# Altium schematic sheet CPCIS_Connectors_P1_P6.SchDoc
size 420 x 297 mm; Organization: WUT; DocumentNumber: 1; SheetNumber: 10; Title2: CPCIS Connectors; SPICEModelCacheRMUUFYQV: <root> / <DocumentId>RMUUFYQV</DocumentId> / <CacheFrame Number="0"> / <Model Name="kpp" Kind="GlobalParam"> / <Text>.param KPP = 3.0E-05</Text> / </Model> / <Model Name="ldp" Kind="GlobalParam"> / <Text>.param LDP = 0.07U</Text> / </Model> / <Model Name="vtop" Kind="GlobalParam"> / <Text>.param VTOP = 0.14</Text> / </Model> / <Model Name="rpar" Kind="GlobalParam"> / <Text>.param RPAR = 1T</Text> / </Model> / <Model Name="cbdj" Kind="GlobalParam"> / <Text>.param CBDJ = 1</Text> / </Model> / <Model Name="cn" Kind="GlobalParam"> / <Text>.param CN = 0.8</Text> / </Model> / <Model Name="cjp" Kind="GlobalParam"> / <Text>.param CJP = CN*300U</Text> / <Dependency>0\cn</Dependency> / </Model> / <Model Name="ls" Kind="GlobalParam"> / <Text>.param LS = 1.0U</Text> / </Model> / <Model Name="cbds" Kind="GlobalParam"> / <Text>.param CBDS = 1</Text> / </Model> / <Model Name="cjswp" Kind="GlobalParam"> / <Text>.param CJSWP = CN*2.2N</Text> / <Dependency>0\cn</Dependency> / </Model> / <Model Name="epssio2" Kind="GlobalParam"> / <Text>.param EPSSIO2 = 3.9*8.854214871E-12</Text> / </Model> / <Model Name="tox" Kind="GlobalParam"> / <Text>.param TOX = 1000E-10</Text> / </Model> / <Model Name="cox" Kind="GlobalParam"> / <Text>.param COX = EPSSIO2/TOX</Text> / <Dependency>0\epssio2</Dependency> / <Dependency>0\tox</Dependency> / </Model> / <Model Name="xjn" Kind="GlobalParam"> / <Text>.param XJN = 0.2U</Text> / </Model> / <Model Name="cgsop" Kind="GlobalParam"> / <Text>.param CGSOP = CN*0.6 * XJN * COX</Text> / <Dependency>0\cn</Dependency> / <Dependency>0\xjn</Dependency> / <Dependency>0\cox</Dependency> / </Model> / <Model Name="cgdop" Kind="GlobalParam"> / <Text>.param CGDOP = CGSOP</Text> / <Dependency>0\cgsop</Dependency> / </Model> / <Model Name="isz" Kind="GlobalParam"> / <Text>.param ISZ = 5P</Text> / </Model> / <Model Name="kpn" Kind="GlobalParam"> / <Text>.param KPN = 6.0E-05</Text> / </Model> / <Model Name="ldn" Kind="GlobalParam"> / <Text>.param LDN = 0.07U</Text> / </Model> / <Model Name="rsw" Kind="GlobalParam"> / <Text>.param RSW = 1810</Text> / </Model> / <Model Name="rsn" Kind="GlobalParam"> / <Text>.param RSN = 1.41</Text> / </Model> / <Model Name="vbmul" Kind="GlobalParam"> / <Text>.param VBMUL = 1E6</Text> / </Model> / <Model Name="vtohp" Kind="GlobalParam"> / <Text>.param VTOHP = 0.85</Text> / </Model> / <Model Name="lambda" Kind="GlobalParam"> / <Text>.param LAMBDA = 2M</Text> / </Model> / <Model Name="vtohn" Kind="GlobalParam"> / <Text>.param VTOHN = 0.80</Text> / </Model> / <Model Name="ibias" Kind="CKT"> / <Text>* / .SUBCKT IBIAS VCC GND VIB / * / .PARAM M1 = 8 / .PARAM M2 = 5 / .PARAM MP = 1 / .PARAM WP = 13U / .PARAM WN = 130U / .PARAM LPE = {36U - LDP} / .PARAM LNE = {13U - LDN} / .PARAM BP = {MP*(WP/LPE)*(KPP/2)} / .PARAM WW = 13U / .PARAM LW = 213U / .PARAM WNN = 25U / .PARAM LNN = 87U / .PARAM R1 = {(RSW*LW/WW + RSN*LNN/WNN)} / .PARAM K2 = {M2*(WN/LNE)*(KPN/2)} / .PARAM MR = {M2/M1} / * / R1 VIB GND {VBMUL} / GB  VCC VIB  VALUE = {LIMIT( IF ( V(VCC,GND) &gt; VTOHP, BP*PWR(V(VCC,GND)-VTOHP, 2), 0), / + (1 + 1*LAMBDA*(V(VCC,GND) - VTOHN))*PWR(( 1 - SQRT(MR/(1+2*LAMBDA*(V(VCC,GND) - VTOHP))) )/R1, 2)/K2, 0)} / R2 VIB VCC {RPAR} / .ENDS</Text> / <Dependency>0\kpp</Dependency> / <Dependency>0\kpn</Dependency> / <Dependency>0\ldn</Dependency> / <Dependency>0\ldp</Dependency> / <Dependency>0\rsw</Dependency> / <Dependency>0\rsn</Dependency> / <Dependency>0\vbmul</Dependency> / <Dependency>0\vtohp</Dependency> / <Dependency>0\lambda</Dependency> / <Dependency>0\vtohn</Dependency> / <Dependency>0\rpar</Dependency> / </Model> / <Model Name="vton" Kind="GlobalParam"> / <Text>.param VTON = 0.14</Text> / </Model> / <Model Name="cjn" Kind="GlobalParam"> / <Text>.param CJN = CN*180U</Text> / <Dependency>0\cn</Dependency> / </Model> / <Model Name="cjswn" Kind="GlobalParam"> / <Text>.param CJSWN = CN*1N</Text> / <Dependency>0\cn</Dependency> / </Model> / <Model Name="cgson" Kind="GlobalParam"> / <Text>.param CGSON = CN*0.6 * XJN * COX</Text> / <Dependency>0\cn</Dependency> / <Dependency>0\xjn</Dependency> / <Dependency>0\cox</Dependency> / </Model> / <Model Name="cgdon" Kind="GlobalParam"> / <Text>.param CGDON = CGSON</Text> / <Dependency>0\cgson</Dependency> / </Model> / <Model Name="tlc55x_rwelld" Kind="CKT"> / <Text>*$ / .SUBCKT TLC55X_RWELLD  1 2 PARAMS: W = 10U L = 100U / R1 1 2 {RSW*L/W} / .ENDS</Text> / <Dependency>0\rsw</Dependency> / </Model> / <Model Name="tlc55x_rwell" Kind="CKT"> / <Text>*+ RSH= 10 / *$ / .SUBCKT TLC55X_RWELL  1 2 PARAMS: W = 10U L = 100U / XR1 1 2 TLC55X_RWELLD PARAMS: W = {W} L = {L} / .ENDS</Text> / <Dependency>0\tlc55x_rwelld</Dependency> / </Model> / <Model Name="mdswn" Kind="CKT"> / <Text>.SUBCKT MDSWN D S DG GND PARAMS: W = 100U L = 10U M = 1 / * / .PARAM LE = {L - LDN} / * / S1 D S DG GND SWN / C1 D S {M*(CBDJ*CJN*LS*W + CBDS*CJSWN*(2*LS + W))} / *D B / .MODEL SWN VSWITCH ( VON = {0.55} VOFF = {0.49} RON={1/(2*M*(W/LE)*(KPN/2)*10)} ROFF={1G} ) / .ENDS</Text> / <Dependency>0\kpn</Dependency> / <Dependency>0\ldn</Dependency> / <Dependency>0\cbdj</Dependency> / <Dependency>0\cjn</Dependency> / <Dependency>0\ls</Dependency> / <Dependency>0\cbds</Dependency> / <Dependency>0\cjswn</Dependency> / </Model> / <Model Name="ccg" Kind="GlobalParam"> / <Text>.param CCG = 0.2</Text> / </Model> / <Model Name="xjncg" Kind="GlobalParam"> / <Text>.param XJNCG = 0.2U</Text> / </Model> / <Model Name="toxcg" Kind="GlobalParam"> / <Text>.param TOXCG = 1000E-10</Text> / </Model> / <Model Name="coxcg" Kind="GlobalParam"> / <Text>.param COXCG = EPSSIO2/TOXCG</Text> / <Dependency>0\epssio2</Dependency> / <Dependency>0\toxcg</Dependency> / </Model> / <Model Name="cgsoncg" Kind="GlobalParam"> / <Text>.param CGSONCG = CCG*0.6 * XJNCG * COXCG</Text> / <Dependency>0\ccg</Dependency> / <Dependency>0\xjncg</Dependency> / <Dependency>0\coxcg</Dependency> / </Model> / <Model Name="cgdoncg" Kind="GlobalParam"> / <Text>.param CGDONCG = CGSONCG</Text> / <Dependency>0\cgsoncg</Dependency> / </Model> / <Model Name="cjncg" Kind="GlobalParam"> / <Text>.param CJNCG = CCG*180U</Text> / <Dependency>0\ccg</Dependency> / </Model> / <Model Name="cjswncg" Kind="GlobalParam"> / <Text>.param CJSWNCG = CCG*1N</Text> / <Dependency>0\ccg</Dependency> / </Model> / <Model Name="vtomp" Kind="GlobalParam"> / <Text>.param VTOMP = 0.6</Text> / </Model> / <Model Name="tlc55x_pmosd_mv" Kind="MDL"> / <Text>*$ / .MODEL TLC55X_PMOSD_MV PMOS LEVEL=1 L=10U W=100U KP={KPP} VTO={-VTOMP} LAMBDA=2E-3 / *+ CJ={CJP} CJSW={CJSWP} CGSO={CGSOP} CGDO={CGDOP} PB=0.65 LD=70N TOX={TOX} / + CJ={CJNCG} CJSW={CJSWNCG} CGSO={CGSONCG} CGDO={CGDONCG} PB=0.65 LD= 70N TOX={TOXCG}</Text> / <Dependency>0\cgdoncg</Dependency> / <Dependency>0\cgsoncg</Dependency> / <Dependency>0\cjncg</Dependency> / <Dependency>0\cjswncg</Dependency> / <Dependency>0\kpp</Dependency> / <Dependency>0\toxcg</Dependency> / <Dependency>0\vtomp</Dependency> / </Model> / <Model Name="tlc55x_pmos_mv" Kind="CKT"> / <Text>*$ / .SUBCKT TLC55X_PMOS_MV  D G S B PARAMS: W = 100U L = 10U M = 1 / M1 D G S B TLC55X_PMOSD_MV W = {W} L = {L} M = {M} AD={W*LS} AS={W*LS} PD={W + 2*LS} PS={W + 2*LS} / + NRD={LS/W} NRS={LS/W} / .ENDS</Text> / <Dependency>0\tlc55x_pmosd_mv</Dependency> / <Dependency>0\ls</Dependency> / </Model> / <Model Name="mdswp" Kind="CKT"> / <Text>.SUBCKT MDSWP D S DG GND PARAMS: W = 100U L = 10U M = 1 / * / .PARAM LE = {L - LDP} / * / S1 D S DG GND SWN / C1 D S {M*(CBDJ*CJP*LS*W + CBDS*CJSWP*(2*LS + W))} / *D B / .MODEL SWN VSWITCH ( VON = {0.49} VOFF = {0.55} RON={1/(2*M*(W/LE)*(KPP/2)*10)} ROFF={1G} ) / .ENDS</Text> / <Dependency>0\kpp</Dependency> / <Dependency>0\ldp</Dependency> / <Dependency>0\cbdj</Dependency> / <Dependency>0\cjp</Dependency> / <Dependency>0\ls</Dependency> / <Dependency>0\cbds</Dependency> / <Dependency>0\cjswp</Dependency> / </Model> / <Model Name="comp2inpnorsd" Kind="CKT"> / <Text>.SUBCKT COMP2INPNORSD IN1+ IN1- IN2+ IN2- OUT GND / + PARAMS: ROUT=0 DELAYLH=0 DELAYHL=0 VOUTH=0 VOUTL=0 VTHRES1=0 VTHRES2=0 / * / .PARAM TDELLH = {IF ( (DELAYLH &lt; 1E-9) , 1E-9, DELAYLH ) } / .PARAM TDELHL = {IF ( (DELAYHL &lt; 1E-9) , 1E-9, DELAYHL ) } / .PARAM RO = {IF ( (TDEL &gt; 1E-15) &amp; (ROUT &lt; 1), 1, ROUT ) } / .PARAM TDEL = {(TDELLH+TDELHL)/2} / .PARAM COUT={TDEL/(0.693*(RO+1U))} / .PARAM RDELLH = {TDELLH/(0.693*(COUT+1F))} / .PARAM RDELHL = {TDELHL/(0.693*(COUT+1F))} / EOUT OUT GND VALUE= { IF ( (V(IN1+,IN1-) &gt; {VTHRES1}) | (V(IN2+,IN2-) &gt; {VTHRES2}), / + VOUTL + RDELLH*I(EOUT), VOUTH + RDELHL*I(EOUT) ) } / COUT OUT GND {COUT} / .ENDS COMP2INPNORSD</Text> / </Model> / <Model Name="comp3inpnorsd" Kind="CKT"> / <Text>.SUBCKT COMP3INPNORSD IN1+ IN1- IN2+ IN2- IN3+ IN3- OUT VCC GND / + PARAMS: ROUT=0 DELAYLH=0 DELAYHL=0 VOUTH=0 VOUTL=0 VTHRES1=0 VHYST1=0 VTHRES2=0 VHYST2=0 VTHRES3=0 VHYST3=0 / * / .PARAM TDELLH = {IF ( (DELAYLH &lt; 1E-9) , 1E-9, DELAYLH ) } / .PARAM TDELHL = {IF ( (DELAYHL &lt; 1E-9) , 1E-9, DELAYHL ) } / .PARAM RO = {IF ( (TDEL &gt; 1E-15) &amp; (ROUT &lt; 1), 1, ROUT ) } / .PARAM TDEL = {(TDELLH+TDELHL)/2} / .PARAM COUT={TDEL/(0.693*(RO+1U))} / .PARAM VREFN = {(15-VTOHN)} / .PARAM VREFP = {(15-VTOHP)} / .PARAM RDELLH = {TDELLH/(0.693*(COUT+1F))*VREFP} / .PARAM RDELHL = {TDELHL/(0.693*(COUT+1F))*VREFN} / * / EOUT OUT GND VALUE= { IF ( (V(IN1+,IN1-) &gt; {VTHRES1}) | (V(IN2+,IN2-) &gt; {VTHRES2}) | (V(IN3+,IN3-) &gt; {VTHRES3}), / + VOUTL + RDELLH*I(EOUT)*V(1,GND), VOUTH + RDELHL*I(EOUT)*V(1,GND) ) } / E1 1 GND VALUE= { IF ( (V(VCC,GND) &gt; {VTOHP+0.01}), 1/(V(VCC,GND)-VTOHP), 100 ) } / COUT OUT GND {COUT} / .ENDS COMP3INPNORSD</Text> / <Dependency>0\vtohn</Dependency> / <Dependency>0\vtohp</Dependency> / </Model> / <Model Name="rr1sff" Kind="CKT"> / <Text>.SUBCKT RR1SFF S R R1 Q  Q_ VCC GND / + PARAMS: VOUTH=5.0 VOUTL=0 RIN=1E12 DELAY=10N ROUT=10 / .PARAM W1 = 100U / .PARAM L1 = 10U / .PARAM W2 = 100U / .PARAM L2= 10U / .PARAM W3 = 10U / .PARAM L3 = 25U / .PARAM W4 = 10U / .PARAM L4= 100U / * / XU1     Q GND S GND Q_ GND   COMP2INPNORSD / + PARAMS: ROUT={ROUT} DELAYLH={1N} DELAYHL={1N} VOUTH={VOUTH} VOUTL={VOUTL} / + VTHRES1={0.5*(VOUTH-VOUTL)} VTHRES2={VTOCN} / XU2     VCC R R1 GND Q_ GND Q VCC GND   COMP3INPNORSD / + PARAMS: ROUT={ROUT} DELAYLH={15N} DELAYHL={1N} VOUTH={VOUTH} VOUTL={VOUTL} / + VTHRES1={VTOCP} VTHRES2={VTOCN} VTHRES3={0.49*(VOUTH-VOUTL)} / *C1 S GND {0.5*COX*(W1*L1) + CGSON*W1} / *C2 R VCC {0.5*COX*(W2*L2) + CGSOP*W2} / *C3 R1 GND {0.5*COX*(W3*L3) + CGSON*W3} / *C4 R1 VCC {0.5*COX*(W4*L4) + CGSOP*W4} / .ENDS</Text> / <Dependency>0\comp2inpnorsd</Dependency> / <Dependency>0\comp3inpnorsd</Dependency> / </Model> / <Model Name="vtomn" Kind="GlobalParam"> / <Text>.param VTOMN = 0.55</Text> / </Model> / <Model Name="tlc55x_nmosd_mv" Kind="MDL"> / <Text>*$ / .MODEL TLC55X_NMOSD_MV NMOS LEVEL=1 L=10U W=100U KP={KPN} VTO={VTOMN} LAMBDA=2E-3 / + CJ={CJNCG} CJSW={CJSWNCG} CGSO={CGSONCG} CGDO={CGDONCG} PB=0.65 LD= 70N TOX={TOXCG}</Text> / <Dependency>0\cgdoncg</Dependency> / <Dependency>0\cgsoncg</Dependency> / <Dependency>0\cjncg</Dependency> / <Dependency>0\cjswncg</Dependency> / <Dependency>0\kpn</Dependency> / <Dependency>0\toxcg</Dependency> / <Dependency>0\vtomn</Dependency> / </Model> / <Model Name="tlc55x_nmos_mv" Kind="CKT"> / <Text>*$ / .SUBCKT TLC55X_NMOS_MV  D G S B PARAMS: W = 100U L = 10U M = 1 / M1 D G S B TLC55X_NMOSD_MV W = {W} L = {L} M = {M} AD={W*LS} AS={W*LS} PD={W + 2*LS} PS={W + 2*LS} / + NRD={LS/W} NRS={LS/W} / .ENDS</Text> / <Dependency>0\tlc55x_nmosd_mv</Dependency> / <Dependency>0\ls</Dependency> / </Model> / <Model Name="mswn" Kind="CKT"> / <Text>.SUBCKT MSWN D G S PARAMS: W = 100U L = 10U M = 1 / * / .PARAM LE = {L - LDN} / * / *C1 D S {M*(CBDJ*CJN*LS*W + CBDS*CJSWN*(2*LS + W))} / *D B / *C2 G S {M*2/3*COX*(W*LE) + CGSON*W} / *C3 G D {CGDON*W} / S1 D S G S SWN / .MODEL SWN VSWITCH ( VON = {VTON+1} VOFF = {VTON} RON={1/(2*M*(W/L)*(KPN/2)*10)} ROFF={1G} ) / .ENDS</Text> / <Dependency>0\vton</Dependency> / <Dependency>0\kpn</Dependency> / <Dependency>0\ldn</Dependency> / </Model> / <Model Name="tlc55x_nmosd_hv" Kind="MDL"> / <Text>*$ / .MODEL TLC55X_NMOSD_HV NMOS LEVEL=3 L=10U W=100U KP={KPN} VTO={VTOHN} LAMBDA=2E-3 THETA=1.8E-01 / + CJ={CJN} CJSW={CJSWN} CGSO={CGSON} CGDO={CGDON} RSH= 10 PB=0.65 LD= 70N TOX={TOX}</Text> / <Dependency>0\cgdon</Dependency> / <Dependency>0\cgson</Dependency> / <Dependency>0\cjn</Dependency> / <Dependency>0\cjswn</Dependency> / <Dependency>0\kpn</Dependency> / <Dependency>0\tox</Dependency> / <Dependency>0\vtohn</Dependency> / </Model> / <Model Name="tlc55x_nmos_hv" Kind="CKT"> / <Text>.SUBCKT TLC55X_NMOS_HV  D G S B PARAMS: W = 100U L = 10U M = 1 / M1 D G S B TLC55X_NMOSD_HV W = {W} L = {L} M = {M} AD={W*LS} AS={W*LS} PD={W + 2*LS} PS={W + 2*LS} / + NRD={LS/W} NRS={LS/W} / .ENDS</Text> / <Dependency>0\tlc55x_nmosd_hv</Dependency> / <Dependency>0\ls</Dependency> / </Model> / <Model Name="tlc55x_pmosd_hv" Kind="MDL"> / <Text>*$ / .MODEL TLC55X_PMOSD_HV PMOS LEVEL=3 L=10U W=100U KP={KPP} VTO={-VTOHP} LAMBDA=2E-3 THETA=2.2E-01 / + CJ={CJP} CJSW={CJSWP} CGSO={CGSOP} CGDO={CGDOP} RSH=10 PB=0.65 LD=70N TOX={TOX}</Text> / <Dependency>0\cgdop</Dependency> / <Dependency>0\cgsop</Dependency> / <Dependency>0\cjp</Dependency> / <Dependency>0\cjswp</Dependency> / <Dependency>0\kpp</Dependency> / <Dependency>0\tox</Dependency> / <Dependency>0\vtohp</Dependency> / </Model> / <Model Name="tlc55x_pmos_hv" Kind="CKT"> / <Text>*+ RSH= 10 / *$ / .SUBCKT TLC55X_PMOS_HV  D G S B PARAMS: W = 100U L = 10U M = 1 / M1 D G S B TLC55X_PMOSD_HV W = {W} L = {L} M = {M} AD={W*LS} AS={W*LS} PD={W + 2*LS} PS={W + 2*LS} / + NRD={LS/W} NRS={LS/W} / .ENDS</Text> / <Dependency>0\tlc55x_pmosd_hv</Dependency> / <Dependency>0\ls</Dependency> / </Model> / <Model Name="tlc55x_nmosd_hv_l1" Kind="MDL"> / <Text>*$ / .MODEL TLC55X_NMOSD_HV_L1 NMOS LEVEL=1 L=10U W=100U KP={KPN} VTO={VTOHN} LAMBDA=2E-3 / + CJ={CJN} CJSW={CJSWN} CGSO={CGSON} CGDO={CGDON} RSH= 10 PB=0.65 LD= 70N TOX={TOX}</Text> / <Dependency>0\cgdon</Dependency> / <Dependency>0\cgson</Dependency> / <Dependency>0\cjn</Dependency> / <Dependency>0\cjswn</Dependency> / <Dependency>0\kpn</Dependency> / <Dependency>0\tox</Dependency> / <Dependency>0\vtohn</Dependency> / </Model> / <Model Name="tlc55x_nmos_hv_l1" Kind="CKT"> / <Text>*$ / .SUBCKT TLC55X_NMOS_HV_L1  D G S B PARAMS: W = 100U L = 10U M = 1 / M1 D G S B TLC55X_NMOSD_HV_L1 W = {W} L = {L} M = {M} AD={W*LS} AS={W*LS} PD={W + 2*LS} PS={W + 2*LS} / + NRD={LS/W} NRS={LS/W} / .ENDS</Text> / <Dependency>0\tlc55x_nmosd_hv_l1</Dependency> / <Dependency>0\ls</Dependency> / </Model> / <Model Name="tlc55x_pmosd_lv" Kind="MDL"> / <Text>*+ RSH= 10 / *$ / .MODEL TLC55X_PMOSD_LV PMOS LEVEL=1 L=10U W=100U KP={KPP} VTO={-VTOP} LAMBDA=2E-3 / + CJ={CJP} CJSW={CJSWP} CGSO={CGSOP} CGDO={CGDOP}  PB=0.65 LD=300N TOX={TOX}</Text> / <Dependency>0\cgdop</Dependency> / <Dependency>0\cgsop</Dependency> / <Dependency>0\cjp</Dependency> / <Dependency>0\cjswp</Dependency> / <Dependency>0\kpp</Dependency> / <Dependency>0\tox</Dependency> / <Dependency>0\vtop</Dependency> / </Model> / <Model Name="tlc55x_pmos_lv" Kind="CKT"> / <Text>*$ / .SUBCKT TLC55X_PMOS_LV  D G S B PARAMS: W = 100U L = 10U M = 1 / M1 D G S B TLC55X_PMOSD_LV W = {W} L = {L} M = {M} AD={W*LS} AS={W*LS} PD={W + 2*LS} PS={W + 2*LS} / + NRD={LS/W} NRS={LS/W} / .ENDS</Text> / <Dependency>0\tlc55x_pmosd_lv</Dependency> / <Dependency>0\ls</Dependency> / </Model> / <Model Name="bsh103" Kind="CKT"> / <Text>.SUBCKT BSH103 DRAIN GATE SOURCE / LD DRAIN 5 7e-10 / RLD2 DRAIN 5 1.7592904 / RLD1 5 4 0.00035 / LG GATE 1 2.8e-09 / RLG GATE 1 7.0371616 / LS SOURCE 8 8e-10 / RLS2 SOURCE 8 2.0106176 / RLS1 8 7 0.0069 / RDS 7 4 240000000 TC=-0.05 / RS 6 7 0.0001 / RD 3 4 0.167989599257517 TC=0.00346248128119176,-2.23221620156079e-06 / RBD 9 4 0.0853481926973045 TC=0.00346248128119176,-2.23221620156079e-06 / DBD 7 9 DBD / M1 3 2 6 6 MINT / RGS 2 6 80000000 / CGS 2 6 7.24e-11 / RG 1 2 1.767 / * CGD / C11    11   12   1E-12 / V11    11   0   0Vdc / G11    3 2 VALUE { V(13, 0)*I(V11) } / E11    12   0  3 2  1 / E12    13   0  TABLE {V(12)} / + -10	175 / + -5	175 / + -2	175 / + -1	175 / + -0.5	175 / + -0.2	175 / + -0.1	175 / + 0	175 / + 0.01	175 / + 0.5	100 / + 1	70 / + 1.5	60 / + 2	52 / + 2.5	46 / + 3	41 / + 3.5	38 / + 4	35 / + 4.5	33 / + 5	30 / + 7.5	25 / + 10	20 / + 12.5	19 / + 15	18 / + 17.5	16 / + 20	15 / + 25	14 / .MODEL MINT NMOS(Vto=0.8044653308583916 Kp=2.995 Nfs=600e+09 Eta=0 / + Level=3 L=1e-4 W=1e-4 Gamma=0 Phi=0.6 Is=1e-24 / + Js=0 Pb=0.8 Cj=0 Cjsw=0 Cgso=0 Cgdo=0 Cgbo=0 / + Tox=1e-07 Xj=0 / + U0=600 Vmax=4000) / .MODEL DBD D(Bv=30.00 Ibv=1.00E-05 Rs=1E-6 Is=6.14153744662471e-14 / + N=1 M=0.1 VJ=0.5 Fc=0.5 Cjo=0 Tt=2.5e-09) / .ENDS</Text> / </Model> / <Model Name="pk14" Kind="CKT"> / <Text>*.INC dhvqfn.s / .SUBCKT pk14 / +    1   2   3   4   5   6   7   8   9  10 / +   11  12  13  14 / +   15  16  17  18  19  20  21  22  23  24 / +   25  26  27  28 / * Pin Resistance / r1 1 1001 9.078E-02 / r2 2 1002 8.829E-02 / r3 3 1003 8.731E-02 / r4 4 1004 8.710E-02 / r5 5 1005 8.731E-02 / r6 6 1006 8.829E-02 / r7 7 1007 9.075E-02 / r8 8 1008 9.072E-02 / r9 9 1009 8.809E-02 / r10 10 1010 8.716E-02 / r11 11 1011 8.706E-02 / r12 12 1012 8.720E-02 / r13 13 1013 8.816E-02 / r14 14 1014 9.068E-02 / * Pin Inductance / l1 1001 15 2.981E-09 / l2 1002 16 2.447E-09 / l3 1003 17 2.304E-09 / l4 1004 18 2.291E-09 / l5 1005 19 2.307E-09 / l6 1006 20 2.449E-09 / l7 1007 21 2.971E-09 / l8 1008 22 2.972E-09 / l9 1009 23 2.425E-09 / l10 1010 24 2.286E-09 / l11 1011 25 2.280E-09 / l12 1012 26 2.286E-09 / l13 1013 27 2.425E-09 / l14 1014 28 2.975E-09 / .ENDS pk14</Text> / </Model> / <Model Name="vt" Kind="GlobalParam"> / <Text>.param VT = 1.380649e-23*(273.15+TEMP)/1.60217662e-19</Text> / </Model> / </CacheFrame> / <CacheFrame Number="1"> / <Model Name="iimirrp" Kind="CKT"> / <Text>.SUBCKT IIMIRRP VCC IO II PARAMS: W1 = 100U L1 = 10U M1 = 1 W2 = 100U L2= 10U M2 = 2 IDIN = 1U / * / .PARAM L1E = {L1 - LDP} / .PARAM L2E = {L2 - LDP} / .PARAM B1 = {M1*(W1/L1)*(KPP/2)} / .PARAM MR = {M2*W2/L2E/(M1*W1/L1E)} / .PARAM RDS = {1/(2*SQRT(M2*(W2/L2E)*(KPP/2)*IDIN))} / .PARAM IS = 1E-12 / .PARAM NP = {VTOP/(VT*Log(1 + IDIN/IS))} / * / FB VCC IO V1 {MR} / R1 VCC IO {RPAR} / C1 VCC IO {M2*(CBDJ*CJP*LS*W2 + CBDS*CJSWP*(2*LS + W2))} / D1 IO  10  DMODP / V1 VCC 10 {VTOP} / R2 II 10  {RDS} / C2 VCC II {M1*(CBDJ*CJP*LS*W1 + CBDS*CJSWP*(2*LS + W1)) + 2/3*COX*(M1*W1*L1E + M2*W2*L2E) + M1*CGSOP*W1} / C3 II IO {CGDOP*W2} / .MODEL DMODP D (IS={IS} N={NP} ) / .ENDS</Text> / <Dependency>0\kpp</Dependency> / <Dependency>0\ldp</Dependency> / <Dependency>0\vtop</Dependency> / <Dependency>0\vt</Dependency> / <Dependency>0\rpar</Dependency> / <Dependency>0\cbdj</Dependency> / <Dependency>0\cjp</Dependency> / <Dependency>0\ls</Dependency> / <Dependency>0\cbds</Dependency> / <Dependency>0\cjswp</Dependency> / <Dependency>0\cox</Dependency> / <Dependency>0\cgsop</Dependency> / <Dependency>0\cgdop</Dependency> / </Model> / <Model Name="nz" Kind="GlobalParam"> / <Text>.param NZ = 0.3/(VT*Log(1 + 5.0M/ISZ))</Text> / <Dependency>0\vt</Dependency> / <Dependency>0\isz</Dependency> / </Model> / <Model Name="dz_18v" Kind="MDL"> / <Text>.MODEL DZ_18V D( IS={ISz} N={Nz} BV=18.0 IBV=5.0M EG={8*Nz*VT})</Text> / <Dependency>0\isz</Dependency> / <Dependency>1\nz</Dependency> / <Dependency>0\vt</Dependency> / </Model> / <Model Name="d_z18v" Kind="CKT"> / <Text>* / * CONNECTIONS:   A / *                |    C / *                |    | / .SUBCKT D_Z18V   1    2 / D1 1 2  DZ_18V / .ENDS</Text> / <Dependency>1\dz_18v</Dependency> / </Model> / <Model Name="iimirrn" Kind="CKT"> / <Text>.SUBCKT IIMIRRN GND IO II PARAMS: W1 = 100U L1 = 10U M1 = 1 W2 = 100U L2= 10U M2 = 2 IDIN = 1U / * / .PARAM L1E = {L1 - LDN} / .PARAM L2E = {L2 - LDN} / .PARAM B1 = {M1*(W1/L1)*(KPN/2)} / .PARAM MR = { M2*W2/L2E/(M1*W1/L1E) } / .PARAM RDS = {1/(2*SQRT(M2*(W2/L2E)*(KPN/2)*IDIN))} / .PARAM IS = 1E-12 / .PARAM NN = {VTON/(VT*Log(1 + IDIN/IS))} / * / FB IO GND V1 {MR} / R1 IO GND {RPAR} / C1 IO GND {M2*(CBDJ*CJN*LS*W2 + CBDS*CJSWN*(2*LS + W2))} / D1 10 IO  DMODN / V1 10 GND {VTON} / R2 II 10  {RDS} / C2 II GND {M1*(CBDJ*CJN*LS*W1 + CBDS*CJSWN*(2*LS + W1)) + 2/3*COX*(M1*W1*L1E + M2*W2*L2E) + M1*CGSON*W1} / C3 II IO {M2*CGDON*W2} / .MODEL DMODN D (IS={IS} N={NN} ) / .ENDS</Text> / <Dependency>0\kpn</Dependency> / <Dependency>0\ldn</Dependency> / <Dependency>0\vton</Dependency> / <Dependency>0\vt</Dependency> / <Dependency>0\rpar</Dependency> / <Dependency>0\cbdj</Dependency> / <Dependency>0\cjn</Dependency> / <Dependency>0\ls</Dependency> / <Dependency>0\cbds</Dependency> / <Dependency>0\cjswn</Dependency> / <Dependency>0\cox</Dependency> / <Dependency>0\cgson</Dependency> / <Dependency>0\cgdon</Dependency> / </Model> / <Model Name="imirrp" Kind="CKT"> / <Text>.SUBCKT IMIRRP VCC IO VIB GND PARAMS: W = 100U L = 10U M = 1 IO = 1U / * / .PARAM MP = 1 / .PARAM WP = 13U / .PARAM LPE = {36U - LDP} / .PARAM LE = {L - LDP} / .PARAM MR = { M*W/LE/(MP*WP/LPE)/VBMUL } / .PARAM B1 = { (KPP/2*MP*WP/LPE)*VBMUL } / .PARAM IS = 1E-12 / .PARAM N = {VTOHP/(VT*Log(1 + IO/IS))} / * / GB VCC IO VIB GND {MR} / R1 VCC IO {RPAR} / C1 VCC IO {M*(CBDJ*CJP*LS*W + CBDS*CJSWP*(2*LS + W))} / V1 VCC 10 {VTOHP} / D1 IO  10  DMOD1 / .MODEL DMOD1 D (IS={IS} N={N} ) / .ENDS</Text> / <Dependency>0\kpp</Dependency> / <Dependency>0\vbmul</Dependency> / <Dependency>0\ldp</Dependency> / <Dependency>0\vtohp</Dependency> / <Dependency>0\vt</Dependency> / <Dependency>0\rpar</Dependency> / <Dependency>0\cbdj</Dependency> / <Dependency>0\cjp</Dependency> / <Dependency>0\ls</Dependency> / <Dependency>0\cbds</Dependency> / <Dependency>0\cjswp</Dependency> / </Model> / <Model Name="tlc555" Kind="CKT"> / <Text>.SUBCKT TLC555 THRES CONT TRIG RESET OUT DISC VCC GND / XD8          GND RESI   D_Z18V / XD7          GND RESET   D_Z18V / XR2          RESET RESI   TLC55X_RWELL / + PARAMS: W=50u L=20u / XD2          GND TRGI   D_Z18V / XD1          GND TRIG   D_Z18V / XR3          TRIG TRGI   TLC55X_RWELL / + PARAMS: W=50u L=20u / XD4          GND THRI   D_Z18V / XD3          GND THRES   D_Z18V / XR2_2        THRES THRI   TLC55X_RWELL / + PARAMS: W=50u L=20u / XD6          GND CONTI   D_Z18V / XD5          GND CONT   D_Z18V / XR2_3        CONT CONTI   TLC55X_RWELL / + PARAMS: W=50u L=20u / XMN15        GOUT GND QFF GND   MDSWN / + PARAMS: W=100U L=10U M=7 / XMP15        GOUT VCC QFF GND   MDSWP / + PARAMS: W=195U L=10U M=9 / XMN3         GND TRGO 23   IIMIRRN / + PARAMS: W1=170U L1=18U M1=1 W2=170U L2=18U M2=1 IDIN=1U / XMN5         GND THRS 25   IIMIRRN / + PARAMS: W1=13U L1=26U M1=1 W2=52U L2=13U M2=2 IDIN=50N / XMp9         VCC RESO 15 GND   IMIRRP / + PARAMS: W=112U L=15U M=2 IO=2U / XMp6         VCC 25 15 GND   IMIRRP / + PARAMS: W=18U L=26U M=1 IO=100n / XMp5         VCC TRGS 15 GND   IMIRRP / + PARAMS: W=112U L=15U M=2 IO=2U / XMp1         VCC THRO 29   IIMIRRP / + PARAMS: W1=172U L1=15U M1=1 W2=172U L2=15U M2=1 IDIN=1U / XIB          VCC GND 15   IBIAS / XRSFF        TRGO THRO RESO QFF 30 VCC GND   RR1SFF / + PARAMS: VOUTH=1 VOUTL=0 RIN=1E12 DELAY=30N ROUT=10 / XMN9         TRGO RESO GND   MSWN / + PARAMS: W=100U L=10U M=1 / XMN17        DISC GOUT GND GND   TLC55X_NMOS_HV / + PARAMS: W=350U L=10U M=20 / XMN16        OUT GOUT GND GND   TLC55X_NMOS_HV / + PARAMS: W=175U L=10U M=20 / XMP16        OUT GOUT VCC VCC   TLC55X_PMOS_HV / + PARAMS: W=270u L=10u M=7 / XMN10        RESO RESI GND GND   TLC55X_NMOS_HV_L1 / + PARAMS: W=100u L=10u M=1 / XMN2         THRO THRI THRS GND   TLC55X_NMOS_MV / + PARAMS: W=170u L=18u M=2 / XMP4         TRGO TRGI TRGS VCC   TLC55X_PMOS_MV / + PARAMS: W=172u L=15u M=2 / XMP3         23 TRGC TRGS VCC   TLC55X_PMOS_MV / + PARAMS: W=172u L=15u M=2 / XMPR1F       GND GND 32 TRGC   TLC55X_PMOS_LV / + PARAMS: W=20U L=15U M=1 / XMPR1E       32 32 TRGC TRGC   TLC55X_PMOS_LV / + PARAMS: W=20U L=15U M=1 / XMPR1D       TRGC TRGC 33 CONTI   TLC55X_PMOS_LV / + PARAMS: W=20U L=15U M=1 / XMPR1C       33 33 CONTI CONTI   TLC55X_PMOS_LV / + PARAMS: W=20U L=15U M=1 / XMPR1B       CONTI CONTI 34 VCC   TLC55X_PMOS_LV / + PARAMS: W=20u L=15u M=1 / XMPR1A       34 34 VCC VCC   TLC55X_PMOS_LV / + PARAMS: W=20u L=15u M=1 / XMN1         29 CONTI THRS GND   TLC55X_NMOS_MV / + PARAMS: W=170u L=18u M=2 / .ENDS TLC555</Text> / <Dependency>1\iimirrp</Dependency> / <Dependency>1\d_z18v</Dependency> / <Dependency>0\ibias</Dependency> / <Dependency>1\iimirrn</Dependency> / <Dependency>0\tlc55x_rwell</Dependency> / <Dependency>0\mdswn</Dependency> / <Dependency>0\tlc55x_pmos_mv</Dependency> / <Dependency>0\mdswp</Dependency> / <Dependency>1\imirrp</Dependency> / <Dependency>0\rr1sff</Dependency> / <Dependency>0\tlc55x_nmos_mv</Dependency> / <Dependency>0\mswn</Dependency> / <Dependency>0\tlc55x_nmos_hv</Dependency> / <Dependency>0\tlc55x_pmos_hv</Dependency> / <Dependency>0\tlc55x_nmos_hv_l1</Dependency> / <Dependency>0\tlc55x_pmos_lv</Dependency> / </Model> / </CacheFrame> / </root>; ModifiedDate: -; Rule: PcbType=ProtelPcb
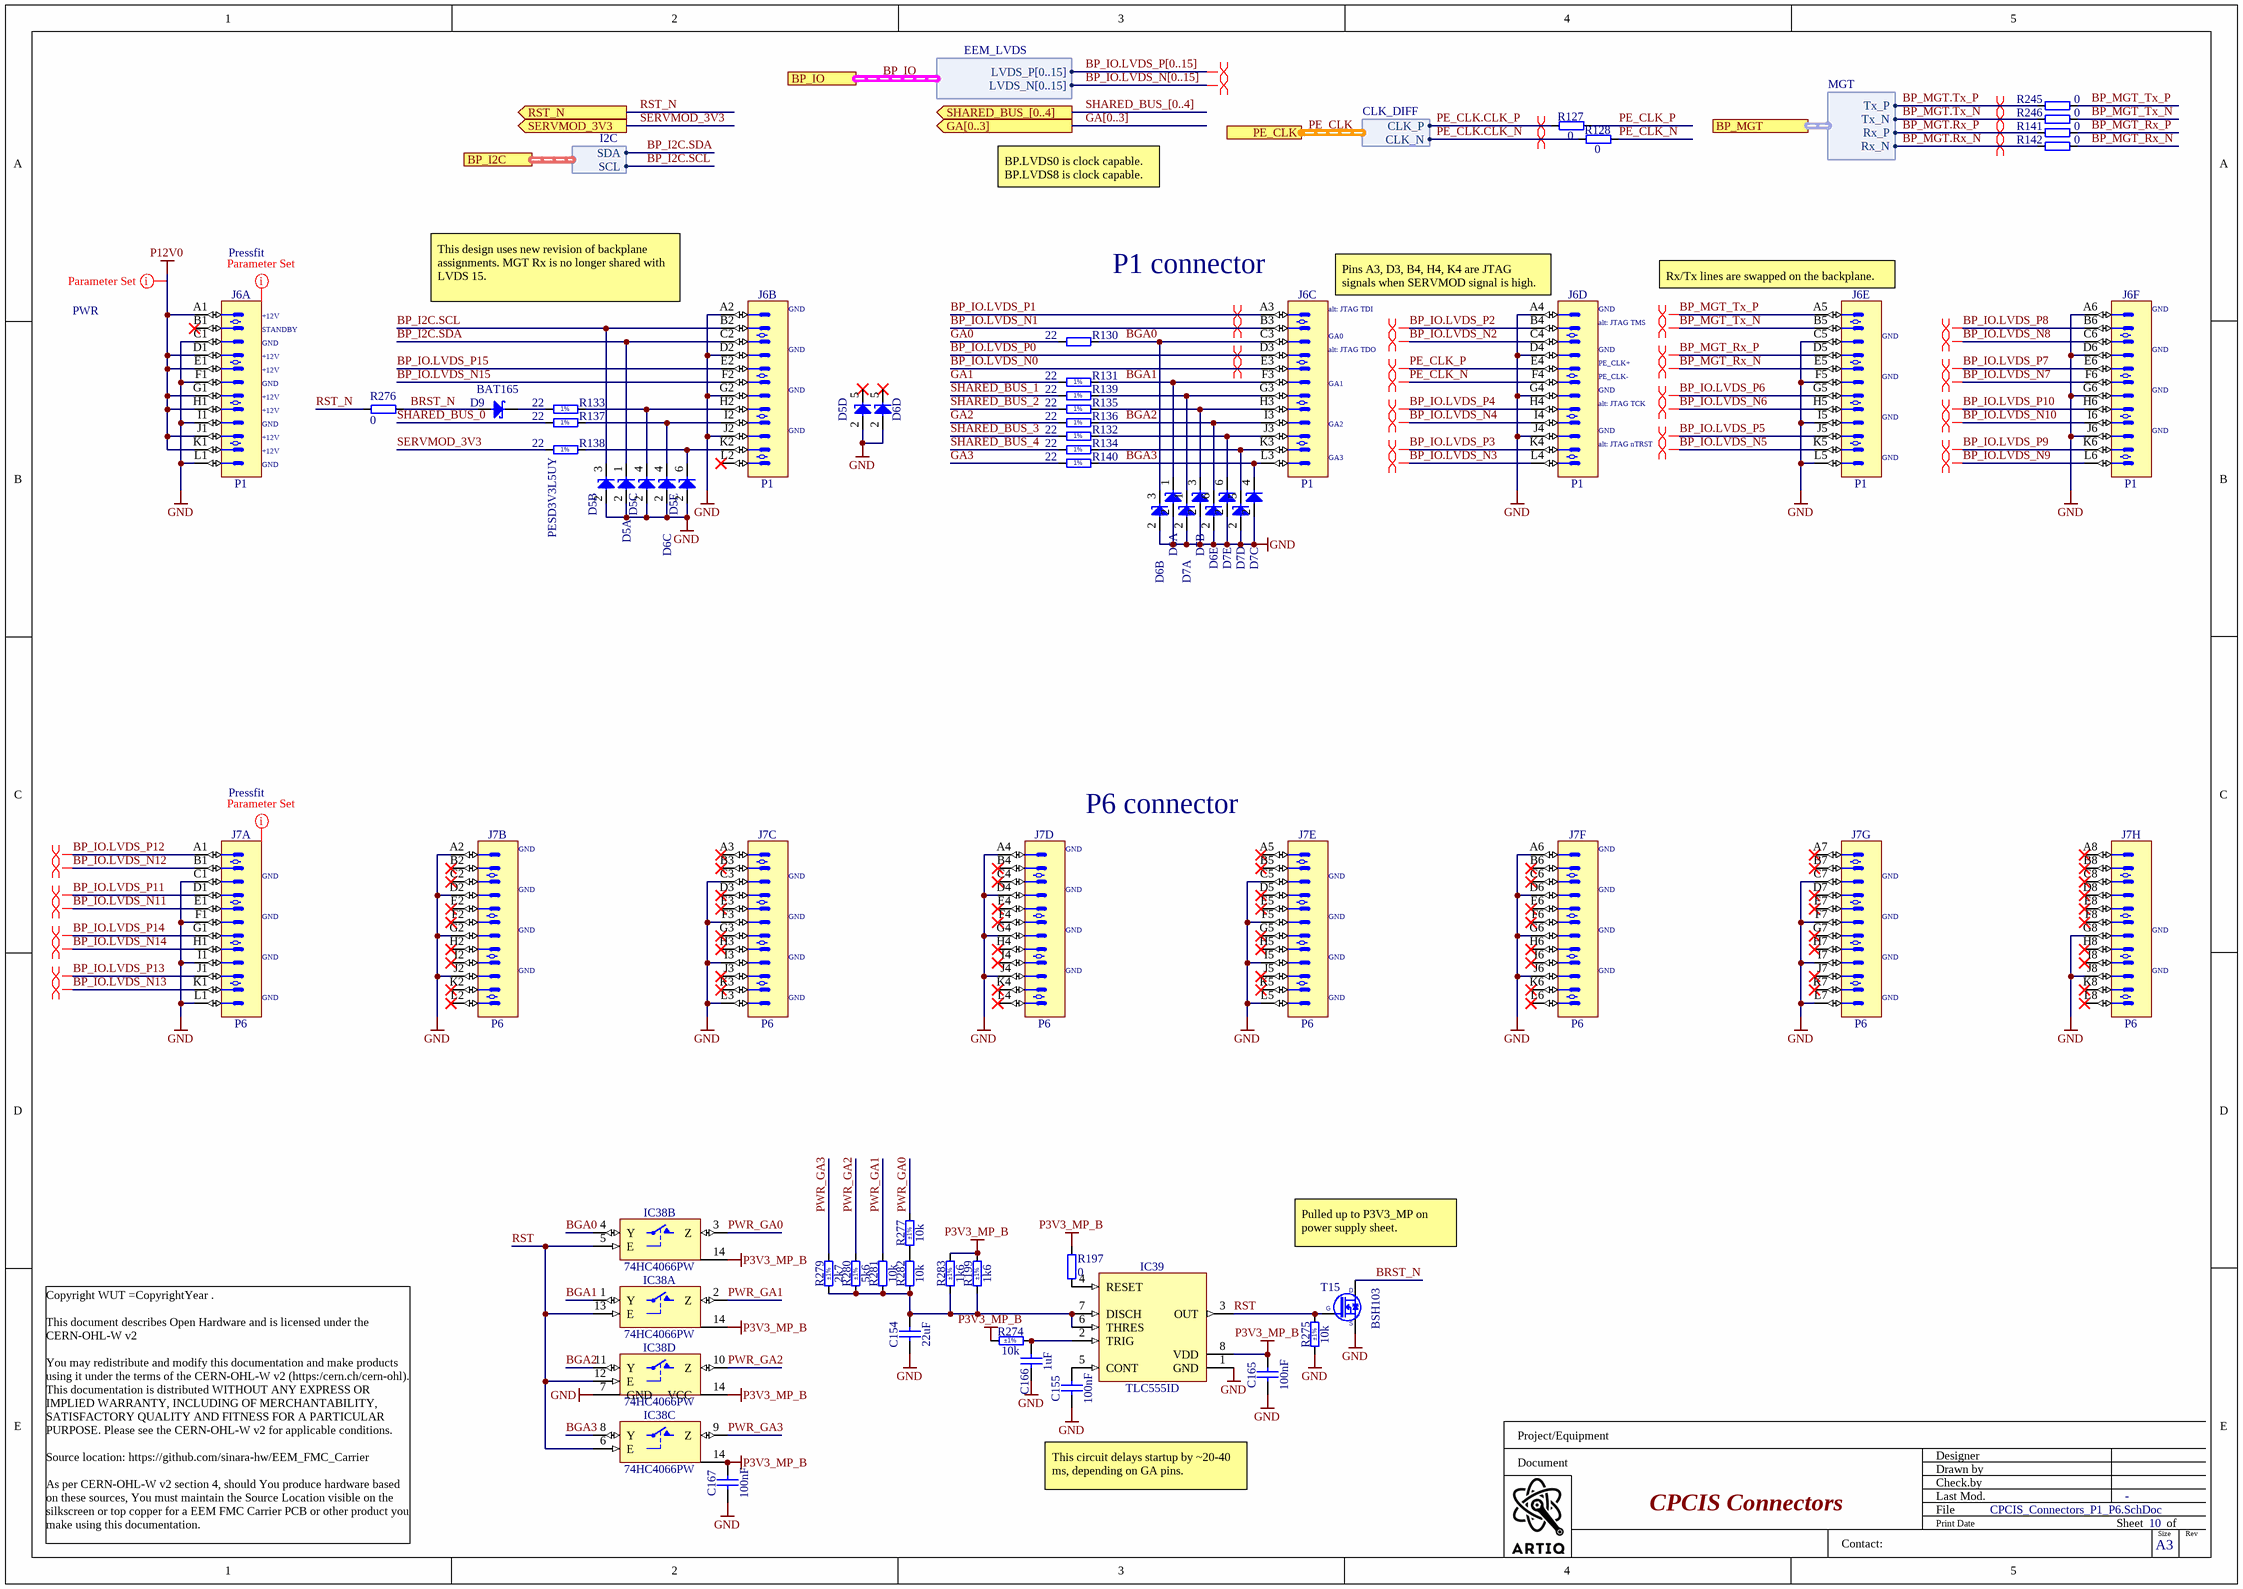
[diagram p0: CPCIS_Connectors_P1_P6.SchDoc]

## Parts
C154  22uF  [CAPC1608X90N]
C155  100nF  [CAPC1005X55N]
C165  100nF  [CAPC1005X55N]
C166  1uF  [CAPC1005X55N]
C167  100nF  [CAPC1005X55N]
D5  PESD3V3L5UY  [SOT65P210X110-6N]  (value not drawn)  (parts A,B,C,D,E of 5)
D6  PESD3V3L5UY  [SOT65P210X110-6N]  (value not drawn)  (parts A,B,C,D,E of 5)
D7  PESD3V3L5UY  [SOT65P210X110-6N]  (value not drawn)  (parts A,B,C,D,E of 5)
D9  BAT165  [SOD2512X110N]
IC38  74HC4066PW  [SOP65P640X110-14N]  (parts A,B,C,D of 4)
IC39  TLC555ID  [SOIC127P600X175-8N]
J6  P1  [AMPHENOL_10052825-101LF]  (parts A,B,C,D,E,F of 6)
J7  P6  [AMPHENOL_10052838-101LF]  (parts A,B,C,D,E,F,G,H of 8)
R127  0  [RESC0603X28N]
R128  0  [RESC0603X28N]
R130  22  [RESC1005X40N]
R131  22  [RESC1005X40N]
R132  22  [RESC1005X40N]
R133  22  [RESC1005X40N]
R134  22  [RESC1005X40N]
R135  22  [RESC1005X40N]
R136  22  [RESC1005X40N]
R137  22  [RESC1005X40N]
R138  22  [RESC1005X40N]
R139  22  [RESC1005X40N]
R140  22  [RESC1005X40N]
R141  0  [RESC0603X28N]
R142  0  [RESC0603X28N]
R197  0  [RESC1005X40N]
R199  1k6  Tolerance: ±1%  [RESC1005X40N]
R245  0  [RESC0603X28N]
R246  0  [RESC0603X28N]
R274  10k  Tolerance: ±1%  [RESC1005X40N]
R275  10k  Tolerance: ±1%  [RESC1005X40N]
R276  0  [RESC1005X40N]
R277  10k  Tolerance: ±1%  [RESC1005X40N]
R279  2k7  Tolerance: ±1%  [RESC1608X55N]
R280  5k6  Tolerance: ±1%  [RESC1005X40N]
R281  10k  [RESC1005X40N]
R282  10k  [RESC1005X40N]
R283  1k6  Tolerance: ±1%  [RESC1005X40N]
T15  BSH103  [SOT95P230X110-3N]

## Ports
BP_I2C (harness I2C), BP_IO (harness EEM_LVDS), BP_MGT (harness MGT), GA[0..3] (out), PE_CLK (harness CLK_DIFF), RST_N (out), SERVMOD_3V3 (out), SHARED_BUS_[0..4] (out)

## Harnesses
MGT: Tx_P, Tx_N, Rx_P, Rx_N
CLK_DIFF: CLK_N, CLK_P
I2C: SDA, SCL
EEM_LVDS: LVDS_P[0..15], LVDS_N[0..15]

## Nets
GND: C154.1 C155.1 C165.1 C166.1 C167.1 D5.2(A) D6.2(A) D7.2(A) IC38.7(GND) IC39.1(GND) J6.A2 J6.A4 J6.A6 J6.C1 J6.C5 J6.D2 J6.D4 J6.D6 J6.F1 J6.F5 J6.G2 J6.G4 J6.G6 J6.I1 J6.I5 J6.J2 J6.J4 J6.J6 J6.L1 J6.L5 J7.A2 J7.A4 J7.A6 J7.C1 J7.C3 J7.C5 J7.C7 J7.D2 J7.D4 J7.D6 J7.F1 J7.F3 J7.F5 J7.F7 J7.G2 J7.G4 J7.G6 J7.G8 J7.I1 J7.I3 J7.I5 J7.I7 J7.J2 J7.J4 J7.J6 J7.J8 J7.L1 J7.L3 J7.L5 J7.L7 R275.1 T15.2(S)
P3V3_MP_B: C165.2 C167.2 IC38.14(VCC) IC39.8(VDD) R197.2 R199.2 R274.1 R283.2
P12V0: J6.A1 J6.D1 J6.E1 J6.G1 J6.H1 J6.J1 J6.K1
BGA0: D6.3(C) IC38.4(Y) J6.C3 R130.2
BGA1: D6.1(C) IC38.1(Y) J6.F3 R131.2
BGA2: D6.6(C) IC38.11(Y) J6.I3 R136.2
BGA3: D7.4(C) IC38.8(Y) J6.L3 R140.2
BP_I2C.SCL: D5.3(C) J6.B2 ; port BP_I2C.SCL
BP_I2C.SDA: D5.1(C) J6.C2 ; port BP_I2C.SDA
BP_IO.LVDS_N0: J6.E3
BP_IO.LVDS_N1: J6.B3
BP_IO.LVDS_N2: J6.C4
BP_IO.LVDS_N3: J6.L4
BP_IO.LVDS_N4: J6.I4
BP_IO.LVDS_N5: J6.K5
BP_IO.LVDS_N6: J6.H5
BP_IO.LVDS_N7: J6.F6
BP_IO.LVDS_N8: J6.C6
BP_IO.LVDS_N9: J6.L6
BP_IO.LVDS_N10: J6.I6
BP_IO.LVDS_N11: J7.E1
BP_IO.LVDS_N12: J7.B1
BP_IO.LVDS_N13: J7.K1
BP_IO.LVDS_N14: J7.H1
BP_IO.LVDS_N15: J6.F2
BP_IO.LVDS_P0: J6.D3
BP_IO.LVDS_P1: J6.A3
BP_IO.LVDS_P2: J6.B4
BP_IO.LVDS_P3: J6.K4
BP_IO.LVDS_P4: J6.H4
BP_IO.LVDS_P5: J6.J5
BP_IO.LVDS_P6: J6.G5
BP_IO.LVDS_P7: J6.E6
BP_IO.LVDS_P8: J6.B6
BP_IO.LVDS_P9: J6.K6
BP_IO.LVDS_P10: J6.H6
BP_IO.LVDS_P11: J7.D1
BP_IO.LVDS_P12: J7.A1
BP_IO.LVDS_P13: J7.J1
BP_IO.LVDS_P14: J7.G1
BP_IO.LVDS_P15: J6.E2
BP_MGT.Rx_N: R142.1 ; port BP_MGT.Rx_N
BP_MGT.Rx_P: R141.1 ; port BP_MGT.Rx_P
BP_MGT.Tx_N: R246.1 ; port BP_MGT.Tx_N
BP_MGT.Tx_P: R245.1 ; port BP_MGT.Tx_P
BP_MGT_Rx_N: J6.E5 R142.2
BP_MGT_Rx_P: J6.D5 R141.2
BP_MGT_Tx_N: J6.B5 R246.2
BP_MGT_Tx_P: J6.A5 R245.2
BRST_N: D9.2(A) R276.1 T15.3(D)
GA0: R130.1
GA1: R131.1
GA2: R136.1
GA3: R140.1
PE_CLK.CLK_N: R128.1 ; port PE_CLK.CLK_N
PE_CLK.CLK_P: R127.1 ; port PE_CLK.CLK_P
PE_CLK_N: J6.F4 R128.2
PE_CLK_P: J6.E4 R127.2
PWR_GA0: IC38.3(Z) R277.2
PWR_GA1: IC38.2(Z) R281.2
PWR_GA2: IC38.10(Z) R280.2
PWR_GA3: IC38.9(Z) R279.2
RST: IC38.5(E) IC38.6(E) IC38.12(E) IC38.13(E) IC39.3(OUT) R275.2 T15.1(G)
RST_N: R276.2 ; port RST_N
SERVMOD_3V3: R138.1 ; port SERVMOD_3V3
SHARED_BUS_0: R137.1
SHARED_BUS_1: R139.1
SHARED_BUS_2: R135.1
SHARED_BUS_3: R132.1
SHARED_BUS_4: R134.1
NetC154_2: C154.2 IC39.6(THRES) IC39.7(DISCH) R199.1 R279.1 R280.1 R281.1 R282.1 R283.1
NetC155_2: C155.2 IC39.5(CONT)
NetC166_2: C166.2 IC39.2(TRIG) R274.2
NetD5_4: D5.4(C) J6.H2 R133.2
NetD5_6: D5.6(C) J6.K2 R138.2
NetD6_4: D6.4(C) J6.I2 R137.2
NetD7_1: D7.1(C) J6.G3 R139.2
NetD7_3: D7.3(C) J6.H3 R135.2
NetD7_5: D7.5(C) J6.K3 R134.2
NetD7_6: D7.6(C) J6.J3 R132.2
NetD9_1: D9.1(C) R133.1
NetIC39_4: IC39.4(RESET) R197.1
NetR277_1: R277.1 R282.2

Not connected (* = marked no-connect by the designer): D5 5(C)*; D6 5(C)*; J6 B1* L2*; J7 A3* A5* A7* A8* B2* B3* B4* B5* B6* B7* B8* C2* C4* C6* C8* D3* D5* D7* D8* E2* E3* E4* E5* E6* E7* E8* F2* F4* F6* F8* G3* G5* G7* H2* H3* H4* H5* H6* H7* H8* I2* I4* I6* I8* J3* J5* J7* K2* K3* K4* K5* K6* K7* K8* L2* L4* L6* L8*

## Buses and harness runs
bus BP_IO.LVDS_N[0..15]
bus BP_IO.LVDS_P[0..15]
bus GA[0..3] = port GA[0..3]
bus SHARED_BUS_[0..4] = port SHARED_BUS_[0..4]
harness BP_IO = port BP_IO
harness PE_CLK = port PE_CLK

## Layout directives
differential pair: (no net found under the mark), BP_IO.LVDS_N0, BP_IO.LVDS_N1, BP_IO.LVDS_N2, BP_IO.LVDS_N3, BP_IO.LVDS_N4, BP_IO.LVDS_N5, BP_IO.LVDS_N6, BP_IO.LVDS_N7, BP_IO.LVDS_N8, BP_IO.LVDS_N9, BP_IO.LVDS_N10, BP_IO.LVDS_N11, BP_IO.LVDS_N12, BP_IO.LVDS_N13, BP_IO.LVDS_N14, BP_IO.LVDS_P0, BP_IO.LVDS_P1, BP_IO.LVDS_P2, BP_IO.LVDS_P3, BP_IO.LVDS_P4, BP_IO.LVDS_P5, BP_IO.LVDS_P6, BP_IO.LVDS_P7, BP_IO.LVDS_P8, BP_IO.LVDS_P9, BP_IO.LVDS_P10, BP_IO.LVDS_P11, BP_IO.LVDS_P12, BP_IO.LVDS_P13, BP_IO.LVDS_P14
differential pair; differential pair class Diff_100Ohm: PE_CLK.CLK_N, PE_CLK.CLK_P, PE_CLK_N, PE_CLK_P
differential pair; differential pair class MGT: BP_MGT.Rx_N, BP_MGT.Rx_P, BP_MGT.Tx_N, BP_MGT.Tx_P, BP_MGT_Rx_N, BP_MGT_Rx_P, BP_MGT_Tx_N, BP_MGT_Tx_P
net class PWR: P12V0
CompClassName: Pressfit: (no net found under the mark)

## Notes on the sheet
- BP.LVDS0 is clock capable.
  BP.LVDS8 is clock capable.
- (near J6) +12V
- This design uses new revision of backplane assignments. MGT Rx is no longer shared with LVDS 15.
- (near J6) GND
- (near J6) P1 connector
- (near J6) alt: JTAG TDI
- (near J6) Pins A3, D3, B4, H4, K4 are JTAG signals when SERVMOD signal is high.
- (near J6) alt: JTAG TMS
- (near J6) Rx/Tx lines are swapped on the backplane.
- (near J6) STANDBY
- GND
- (near J6) alt: JTAG TDO
- (near J6) GA1
- (near J6) GA0
- (near J6) PE_CLK+
- (near J6) PE_CLK-
- (near J6) GA2
- (near J6) GA3
- (near J6) alt: JTAG TCK
- (near J6) alt: JTAG nTRST
- (near J7) GND
- (near J7) P6 connector
- Pulled up to P3V3_MP on power supply sheet.
- This circuit delays startup by ~20-40 ms, depending on GA pins.
- Project/Equipment
- Document
- Designer
- Drawn by
- Check.by
- Copyright WUT =CopyrightYear .
  This document describes Open Hardware and is licensed under the CERN-OHL-W v2
  You may redistribute and modify this documentation and make products using it under the terms of the CERN-OHL-W v2 (https:/cern.ch/cern-ohl). This documentation is distributed WITHOUT ANY EXPRESS OR IMPLIED WARRANTY, INCLUDING OF MERCHANTABILITY, SATISFACTORY QUALITY AND FITNESS FOR A PARTICULAR PURPOSE. Please see the CERN-OHL-W v2 for applicable conditions.
  Source location: https://github.com/sinara-hw/EEM_FMC_Carrier
  As per CERN-OHL-W v2 section 4, should You produce hardware based on these sources, You must maintain the Source Location visible on the silkscreen or top copper for a EEM FMC Carrier PCB or other product you make using this documentation.
- Contact:
- File
- Last Mod.
- Print Date
- Sheet
- Size
- A3
- of
- Rev
- (in symbol R0402_22R_1%_0.0625W_100PPM) 1%

## Library data of the parts
C154 = CC0603_22UF_6.3V_20%_X5R: Non-polarised capacitor; Manufacturer: GENERIC; Part Description: SMD Multilayer Chip Ceramic Capacitor; Manufacturer1 Part Number: C1608X5R0J226M080; Voltage: 6.3V; TC: X5R; Tolerance: ±20%; Part Number: CC0603_22UF_6.3V_20%_X5R; Component Kind: Standard; Component Type: Standard; Pin Count: 2; Value: 22uF; Status: None; Manufacturer Part Number: CC0603_22UF_6.3V_20%_X5R; Case: 0603; Mounted: Yes; Socket: No; SMD: Yes; Sense: No; Manufacturer1 Example: TDK; Manufacturer1 ComponentHeight: 0.9mm; HelpURL: \\cern.ch\dfs\Applications\Altium\Datasheets\CC0603_X5R_TDK_C.pdf; Author: CERN DEM JLC; CreateDate: 2013-12-16; LatestRevisionDate: 2020-12-03
C155 C165 C167 = CC0402_100NF_16V_10%_X5R: Non-polarised capacitor; Part Description: SMD Multilayer Chip Ceramic Capacitor; Manufacturer: GENERIC; Manufacturer1 Part Number: GRM155R61C104KA88D; Voltage: 16V; TC: X5R; Tolerance: ±10%; Part Number: CC0402_100NF_16V_10%_X5R; Component Kind: Standard; Component Type: Standard; Pin Count: 2; Value: 100nF; Status: None; Manufacturer Part Number: CC0402_100NF_16V_10%_X5R; Case: 0402; Mounted: Yes; Socket: No; SMD: Yes; Sense: No; Manufacturer1 Example: MURATA; Manufacturer1 ComponentHeight: 0.55mm; HelpURL: \\cern.ch\dfs\Applications\Altium\Datasheets\CC0402_X5R_MURATA_GRM.pdf; Author: CERN DEM JLC; CreateDate: 10.12.2013; LatestRevisionDate: 10.12.2013
C166 = CC0402_1UF_16V_10%_X5R: Non-polarised capacitor; Part Description: SMD Multilayer Chip Ceramic Capacitor; Manufacturer: GENERIC; Manufacturer1 Part Number: C1005X5R1C105KT; Voltage: 16V; TC: X5R; Tolerance: ±10%; Part Number: CC0402_1UF_16V_10%_X5R; Component Kind: Standard; Component Type: Standard; Pin Count: 2; Value: 1uF; Status: Preferred; Manufacturer Part Number: CC0402_1UF_16V_10%_X5R; Case: 0402; Mounted: Yes; Socket: No; SMD: Yes; Sense: No; Manufacturer1 Example: TDK; Manufacturer1 ComponentHeight: 0.55mm; HelpURL: \\cern.ch\dfs\Applications\Altium\Datasheets\CC0402_X5R_TDK_C.pdf; Author: CERN DEM JLC; CreateDate: 2012-10-25; LatestRevisionDate: 2012-10-25
D5-D7 = PESD3V3L5UY: Fivefold ESD Protection Diode Arrays; Part Description: Fivefold ESD Protection Diode Arrays (30kV); Manufacturer: NEXPERIA; Voltage: 3.3V; Power: 200W; PressFit: No; Bonding: No; Part Number: PESD3V3L5UY; Component Kind: Standard; Component Type: Standard; Device: PESD3V3L5UY; PackageDescription: SOT363, SC-88, 0.65mm Pitch; 6 Pin, 1.25mm W X 2.00mm L X 1.10mm H body, IPC Medium Density; Manufacturer Part Number: PESD3V3L5UY; Pin Count: 6; Case: SOT363; Mounted: Yes; Socket: No; SMD: Yes; Sense: No; ComponentHeight: 1.1mm; HelpURL: \\cern.ch\dfs\Applications\Altium\Datasheets\PESD3V3L5UY.pdf; Author: CERN DEM WB; CreateDate: 05.07.2021; LatestRevisionDate: 05.07.2021
D9 = BAT165: Schottky Diode; Manufacturer: INFINEON; Part Description: Medium Power AF Schottky Diode; Voltage: 40V; Power: 750mA; PressFit: No; Bonding: No; Manufacturer Part Number: BAT165; PackageDescription: Small Outline Diode (SOD-323), 1.70mm W X 1.25mm L X 1.10mm H body,  IPC Medium Density; Part Number: BAT165; Component Kind: Standard; Component Type: Standard; Device: BAT165; Pin Count: 2; Case: SOD323; Mounted: Yes; Socket: No; SMD: Yes; Sense: No; ComponentHeight: 1.1mm; HelpURL: \\cern.ch\dfs\Applications\Altium\Datasheets\BAT165.pdf; Author: CERN DEM JLC; CreateDate: 12.11.2014; LatestRevisionDate: 12.11.2014
IC38 = 74HC4066PW: Part Description: Quad Single-Pole Single-Throw Analog Switch; Manufacturer: NXP SEMICONDUCTORS; PressFit: No; Bonding: No; Table: Standard Logic; Part Number: 74HC4066PW; Component Kind: Standard; Component Type: Standard; Device: 74HC4066PW; PackageDescription: SOP, 14-Leads, Body 4.4x5mm (max), Pitch 0.65mm, IPC Medium Density; Manufacturer Part Number: 74HC4066PW; Pin Count: 14; Case: TSSOP14; Mounted: Yes; Socket: No; SMD: Yes; ComponentHeight: 1.1mm; Author: CERN DEM JLC; HelpURL: \\cern.ch\dfs\Applications\Altium\Datasheets\74HC4066PW.pdf; CreateDate: 2014-11-19; LatestRevisionDate: 2014-11-19
IC39 = TLC555ID: LinCMOS Timer; Manufacturer: TEXAS INSTRUMENTS; PressFit: No; Bonding: No; Part Number: TLC555ID; Component Kind: Standard; Component Type: Standard; Device: TLC555ID; PackageDescription: SOIC 8, Pitch 1.27mm, Body 4x5mm, IPC Medium Density; Part Description: LinCMOS Timer; Manufacturer Part Number: TLC555ID; Pin Count: 8; Case: SOIC8; Mounted: Yes; Socket: No; SMD: Yes; Sense: No; ComponentHeight: 1.75mm; Author: CERN DEM JMW; HelpURL: \\cern.ch\dfs\Applications\Altium\Datasheets\TLC555ID.pdf; CreateDate: 23.08.2016; LatestRevisionDate: 23.08.2016
J6 = AMPHENOL_10052825-101LF: 72 Contacts Header, 6 Columns, 4 Pairs per Column; Part Description: 72 Contacts, 2mm Pitch, 6 Columns, 4 Pairs per Column, 4 Walls, Right Angle Header; Part Number: AMPHENOL_10052825-101LF; Component Kind: Standard; Component Type: Standard; Pin Count: 72; Family: AirMax VS; Mounted: Yes; Socket: No; SMD: No; PressFit: Yes; Sense: No; Status: None; Manufacturer: AMPHENOL; Manufacturer Part Number: 10052825-101LF; ComponentHeight: 15.35mm; HelpURL: \\cern.ch\dfs\Applications\Altium\Datasheets\AMPHENOL_10052825-101LF.pdf; ComponentLink1URL: \\cern.ch\dfs\Applications\Altium\Datasheets\AMPHENOL_10052825-101LF_Application.pdf; ComponentLink1Description: Application; Author: CERN DEM MR; CreateDate: 19/02/2018; LatestRevisionDate: 19/02/2018; Classname: Overlapping
J7 = AMPHENOL_10052838-101LF: 96 Contacts Header, 8 Columns, 4 Pairs per Column; Part Description: 96 Contacts, 2mm Pitch, 8 Columns, 4 Pairs per Column, 4 Walls, Right Angle Header; Part Number: AMPHENOL_10052838-101LF; Component Kind: Standard; Component Type: Standard; Pin Count: 96; Family: AirMax VS; Mounted: Yes; Socket: No; SMD: No; PressFit: Yes; Sense: No; Status: None; Manufacturer: AMPHENOL; Manufacturer Part Number: 10052838-101LF; ComponentHeight: 15.35mm; HelpURL: \\cern.ch\dfs\Applications\Altium\Datasheets\AMPHENOL_10052838-101LF.pdf; ComponentLink1URL: \\cern.ch\dfs\Applications\Altium\Datasheets\AMPHENOL_10052838-101LF_Application.pdf; ComponentLink1Description: Application; Author: CERN DEM MR; CreateDate: 19.02.2018; LatestRevisionDate: 19.02.2018
R127 R128 R141 R142 R245 R246 = R0201_0R_JUMPER: Resistor; Part Description: 1A (0.05R Max DC Resistance) Zero Ohm Jumper; Manufacturer: GENERIC; Manufacturer1 Part Number: CRCW02010000Z0ED; PressFit: No; Part Number: R0201_0R_JUMPER; Component Kind: Standard; Component Type: Standard; Pin Count: 2; Value: 0; Status: Not Recommended; Manufacturer Part Number: R0201_0R_JUMPER; Case: 0201; Mounted: Yes; Sense: No; Socket: No; SMD: Yes; Manufacturer1 Example: VISHAY; Manufacturer1 ComponentHeight: 0.27mm; HelpURL: \\cern.ch\dfs\Applications\Altium\Datasheets\R0201_VISHAY_CRCW e3.pdf; Author: CERN DEM JLC; CreateDate: 2014-11-19; LatestRevisionDate: 2015-01-08
R130-R140 = R0402_22R_1%_0.0625W_100PPM: Resistor - 1%; Part Description: General Purpose Thick Film Chip Resistor; Manufacturer: GENERIC; Manufacturer1 Part Number: 232270672209L; PressFit: No; Part Number: R0402_22R_1%_0.0625W_100PPM; Component Kind: Standard; Component Type: Standard; Pin Count: 2; Value: 22; Status: Not Recommended; Power: 0.0625W; Tolerance: ±1%; Manufacturer Part Number: R0402_22R_1%_0.0625W_100PPM; Case: 0402; Mounted: Yes; Socket: No; SMD: Yes; Manufacturer1 Example: YAGEO PHYCOMP; Manufacturer1 ComponentHeight: 0.4mm; HelpURL: \\cern.ch\dfs\Applications\Altium\Datasheets\R0402_Phycomp_RC0402.pdf; Author: CERN DEM JLC; CreateDate: 03.12.2007; LatestRevisionDate: 17.10.2012; Sense: No
R197 R276 = R0402_0R_JUMPER: Resistor; Part Description: 1A (0.05R Max DC Resistance) Zero Ohm Jumper; Manufacturer: GENERIC; Manufacturer1 Part Number: 232270591001L; Part Number: R0402_0R_JUMPER; Component Kind: Standard; Component Type: Standard; Pin Count: 2; Value: 0; Status: Not recommended; Manufacturer Part Number: R0402_0R_JUMPER; Case: 0402; Mounted: Yes; Sense: No; Socket: No; SMD: Yes; Manufacturer1 Example: YAGEO PHYCOMP; Manufacturer1 ComponentHeight: 0.4mm; HelpURL: \\cern.ch\dfs\Applications\Altium\Datasheets\R0402_Phycomp_RC0402.pdf; Author: CERN DEM JLC; CreateDate: 03.12.2007; LatestRevisionDate: 17.10.2012
R199 R283 = R0402_1K6_1%_0.0625W_100PPM: Resistor - 1%; Part Description: General Purpose Thick Film Chip Resistor; Manufacturer: GENERIC; Manufacturer1 Part Number: 232270671602L; TC: ±100ppm/°C; PressFit: No; Part Number: R0402_1K6_1%_0.0625W_100PPM; Component Kind: Standard; Component Type: Standard; Pin Count: 2; Value: 1k6; Status: Not Recommended; Power: 0.0625W; Manufacturer Part Number: R0402_1K6_1%_0.0625W_100PPM; Case: 0402; Mounted: Yes; Sense: No; Socket: No; SMD: Yes; Manufacturer1 Example: YAGEO PHYCOMP; Manufacturer1 ComponentHeight: 0.4mm; HelpURL: \\cern.ch\dfs\Applications\Altium\Datasheets\R0402_Phycomp_RC0402.pdf; Author: CERN DEM JLC; CreateDate: 2007-12-03; LatestRevisionDate: 2012-10-17
R274 R275 R277 R281 R282 = R0402_10K_1%_0.0625W_100PPM: Resistor - 1%; Part Description: General Purpose Thick Film Chip Resistor; Manufacturer: GENERIC; Manufacturer1 Part Number: 232270671003L; TC: ±100ppm/°C; PressFit: No; Part Number: R0402_10K_1%_0.0625W_100PPM; Component Kind: Standard; Component Type: Standard; Pin Count: 2; Value: 10k; Status: Not Recommended; Power: 0.0625W; Manufacturer Part Number: R0402_10K_1%_0.0625W_100PPM; Case: 0402; Mounted: Yes; Sense: No; Socket: No; SMD: Yes; Manufacturer1 Example: YAGEO PHYCOMP; Manufacturer1 ComponentHeight: 0.4mm; HelpURL: \\cern.ch\dfs\Applications\Altium\Datasheets\R0402_Phycomp_RC0402.pdf; Author: CERN DEM JLC
  R274 R275 R277: CreateDate: 2007-12-03; LatestRevisionDate: 2012-10-17
  R281 R282: Tolerance: ±1%; CreateDate: 03.12.2007; LatestRevisionDate: 17.10.2012
R279 = R0603_2K7_1%_0.1W_100PPM: Resistor - 1%; Part Description: General Purpose Thick Film Chip Resistor; Manufacturer: GENERIC; Manufacturer1 Part Number: RC0603FR-072K7L; Power: 0.1W; TC: ±100ppm/°C; PressFit: No; Part Number: R0603_2K7_1%_0.1W_100PPM; Component Kind: Standard; Component Type: Standard; Pin Count: 2; Value: 2k7; Status: Preferred; Manufacturer Part Number: R0603_2K7_1%_0.1W_100PPM; Case: 0603; Mounted: Yes; Sense: No; Socket: No; SMD: Yes; Manufacturer1 Example: YAGEO PHYCOMP; Manufacturer1 ComponentHeight: 0.55mm; HelpURL: \\cern.ch\dfs\Applications\Altium\Datasheets\R0603_PHYCOMP_RC0603.pdf; Author: CERN DEM JLC; CreateDate: 2011-05-02; LatestRevisionDate: 2011-05-02
R280 = R0402_5K6_1%_0.0625W_100PPM: Resistor - 1%; Part Description: General Purpose Thick Film Chip Resistor; Manufacturer: GENERIC; Manufacturer1 Part Number: 232270675602L; TC: ±100ppm/°C; PressFit: No; Part Number: R0402_5K6_1%_0.0625W_100PPM; Component Kind: Standard; Component Type: Standard; Pin Count: 2; Value: 5k6; Status: Not Recommended; Power: 0.0625W; Manufacturer Part Number: R0402_5K6_1%_0.0625W_100PPM; Case: 0402; Mounted: Yes; Sense: No; Socket: No; SMD: Yes; Manufacturer1 Example: YAGEO PHYCOMP; Manufacturer1 ComponentHeight: 0.4mm; HelpURL: \\cern.ch\dfs\Applications\Altium\Datasheets\R0402_Phycomp_RC0402.pdf; Author: CERN DEM JLC; CreateDate: 2007-12-03; LatestRevisionDate: 2012-10-17
T15 = BSH103: N-CHANNEL MOSFET WITH DIODE; Part Description: 30V 850mA N-Channel Enhancement Mode Field-Effect Transistor; Manufacturer: NEXPERIA; PressFit: No; Bonding: No; Part Number: BSH103; Component Kind: Standard; Component Type: Standard; Device: BSH103; PackageDescription: SOT23, 0.95mm Pitch; 3 Pin, 1.30mm W X 2.90mm L X 1.10mm H body, IPC Medium Density; Manufacturer Part Number: BSH103; Pin Count: 3; Case: SOT23-3; Mounted: Yes; Socket: No; SMD: Yes; Sense: No; ComponentHeight: 1.1mm; HelpURL: \\cern.ch\dfs\Applications\Altium\Datasheets\BSH103.pdf; Author: CERN DEM JLC; CreateDate: 16.03.2010; LatestRevisionDate: 20.06.2017